# EAGLE design OptoTest (EAGLE 8.2.2)
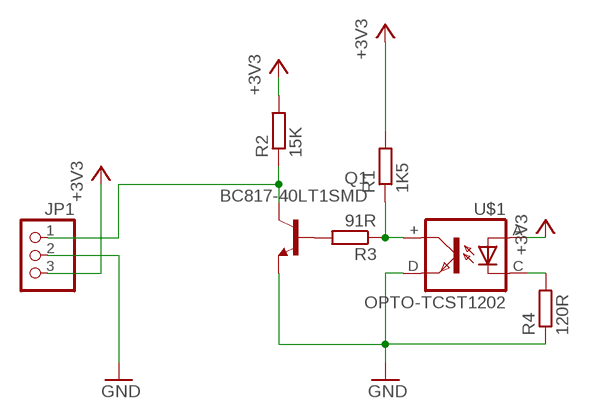
[diagram p0: schematic, sheet 1]

## Parts
JP1  PINHD-1X3/90  [1X03/90]
Q1  BC817-40LT1SMD  [SOT23-BEC]
R1  1K5  R_0805  [R0805]
R2  15K  R_0805  [R0805]
R3  91R  R_0805  [R0805]
R4  120R  R_0805  [R0805]
U$1  OPTO-TCST1202  [TCST1202]

## Nets
+3V3: JP1.3 R1.2 R2.2 U$1.A
GND: JP1.2 Q1.E R4.1 U$1.D(EMIT)
N$1: R1.1 R3.1 U$1.+(COL)
N$2: Q1.B R3.2
N$3: JP1.1 Q1.C R2.1
N$4: R4.2 U$1.C

## Library data of the parts
JP1 = pinhead:PINHD-1X3: PIN HEADER
Q1 = transistor-npn:BC817*: NPN Transistor
R1-R4 = Namenlos:R_
U$1 = Namenlos:OPTO-TCST1202

## Board
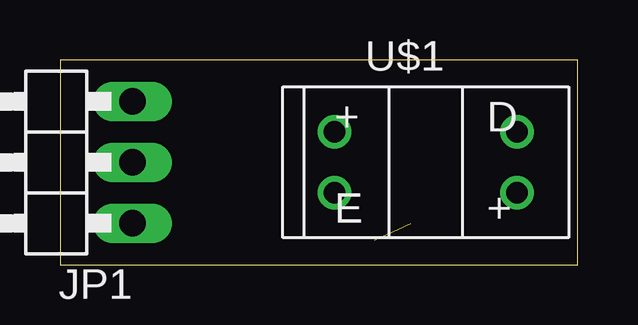
[diagram p1: board, top side]
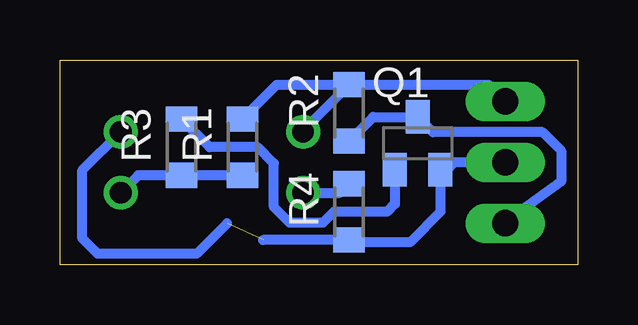
[diagram p2: board, bottom side, seen from below]

Size 21.57 x 8.56 mm. Coordinates in mm from the lower left corner, seen from the top.
Outline: 0,0 21.57,0 21.57,8.56 0,8.56 0,0
Copper layers (1*16): Top 0.035mm / dielectric 1.5mm / Bottom 0.035mm
Design rules "default": minimum track width 6mil, minimum drill 0.35mm, track to track 6mil, track to pad 6mil, pad to pad 6mil, via to via 6mil, smd to smd 6mil, copper to edge 40mil, drill to drill 6mil, minimum pad ring 10mil, minimum via ring 8mil, stop-mask expansion 4mil, vias tented up to drill 0mil, thermal gap 10mil

### Footprints (pad centres in the part's own frame; a part is rotated, then mirrored left to right if it is on the bottom)
1X03/90 = drill 1.1 long: 1 -2.54,-3.81; 2 0,-3.81; 3 2.54,-3.81
SOT23-BEC = smd 1 x 1.4: B -0.95,-1.1; C 0,1.1; E 0.95,-1.1
R0805 = smd 1.05 x 1.3: 1 -1.175,0; 2 1.175,0
TCST1202 = drill 0.9: + 3.8,-1.27; A -3.8,1.27; C -3.8,-1.27; D 3.8,1.27

### Placement (x,y rotation side)
JP1  -0.79,4.29 90 top
Q1  6.67,5.08 0 bottom
R1  13.97,4.92 90 bottom
R2  9.53,6.35 90 bottom
R3  16.51,4.92 90 bottom
R4  9.53,2.22 90 bottom
U$1  15.24,4.29 0 top

### Tracks (layer width: path | path; a pad name or v marks a point on that pad's centre or on a via)
+3V3
  Bottom 0.406: U$1.A 11.44,5.61 R2.2 | R1.2 12.54,7.53 R2.2 | R2.2 3.71,7.53 JP1.3
GND  (1 unrouted)
  Bottom 0.406: 14.61,1.75 15.88,0.48 20,0.48 20.64,1.11 20.64,3.96 U$1.D | 9.86,1.05 R4.1 | 9.86,1.05 13.11,1.05 | 5.72,3.72 Q1.E | 5.72,3.72 5.72,2.22 6.99,0.95 9.76,0.95 9.86,1.05 | JP1.2 5.15,4.29 5.72,3.72
N$1
  Bottom 0.406: 18.58,3.02 U$1.+ 18.31,3.75 R3.1 R1.1
N$2
  Bottom 0.406: Q1.B 7.62,2.54 7.94,2.22 10.16,2.22 10.62,1.76 12.01,1.76 12.66,2.42 12.66,4.25 13.34,4.92 15.34,4.92 R3.2
N$3
  Bottom 0.406: R2.1 8.52,6.18 Q1.C 6.03,5.55 1.46,5.55 0.69,4.78 0.69,3.48 3.02,1.79 JP1.1
N$4
  Bottom 0.406: U$1.C 9.91,3.02 R4.2